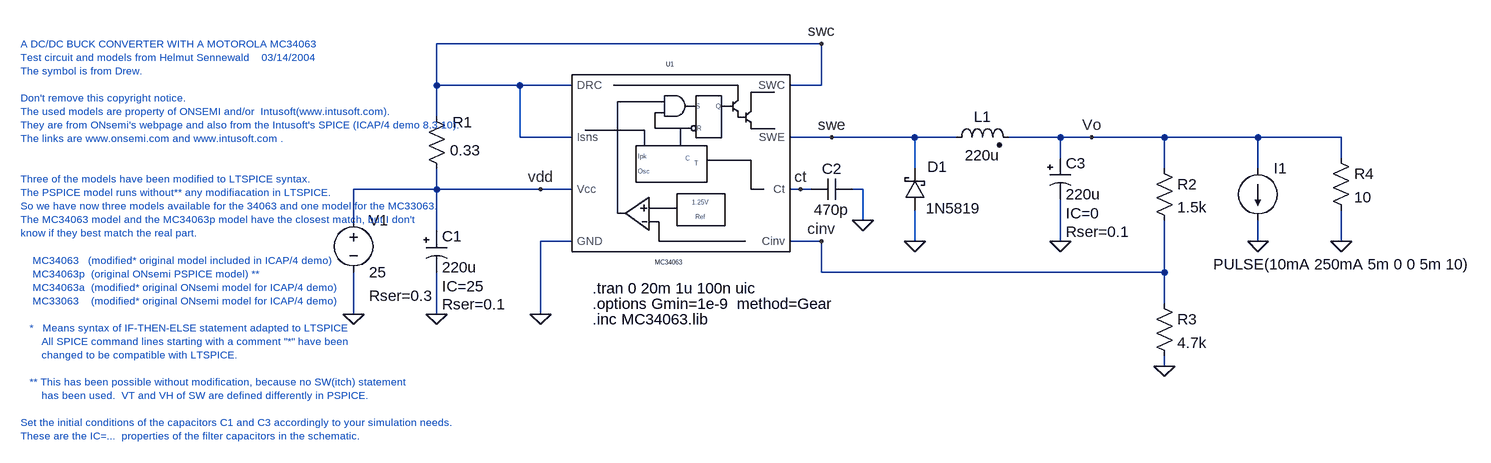
[diagram p0: schematic MC34063_buck.asc]
MC34063_buck.asc, the LTspice schematic file:
Version 4
SHEET 1 1572 772
WIRE 320 64 -272 64
WIRE -272 128 -272 64
WIRE -144 128 -272 128
WIRE -64 128 -144 128
WIRE 320 128 320 64
WIRE 320 128 272 128
WIRE -272 176 -272 128
WIRE -144 208 -144 128
WIRE -64 208 -144 208
WIRE 336 208 272 208
WIRE 464 208 336 208
WIRE 528 208 464 208
WIRE 688 208 608 208
WIRE 736 208 688 208
WIRE 848 208 736 208
WIRE 992 208 848 208
WIRE 1120 208 992 208
WIRE 688 240 688 208
WIRE 1120 240 1120 208
WIRE 464 256 464 208
WIRE 848 256 848 208
WIRE 992 256 992 208
WIRE -272 288 -272 256
WIRE -272 288 -400 288
WIRE -112 288 -272 288
WIRE -64 288 -112 288
WIRE 288 288 272 288
WIRE 304 288 288 288
WIRE 384 288 368 288
WIRE -400 336 -400 288
WIRE 384 336 384 288
WIRE -272 352 -272 288
WIRE -64 368 -112 368
WIRE 320 368 272 368
WIRE 464 368 464 320
WIRE 688 368 688 304
WIRE 992 368 992 336
WIRE 1120 368 1120 320
WIRE 320 416 320 368
WIRE 848 416 848 336
WIRE 848 416 320 416
WIRE 848 464 848 416
WIRE -400 480 -400 416
WIRE -272 480 -272 416
WIRE -112 480 -112 368
WIRE 848 560 848 544
FLAG -400 480 0
FLAG -272 480 0
FLAG 384 336 0
FLAG 464 368 0
FLAG 688 368 0
FLAG 736 208 Vo
FLAG 848 560 0
FLAG 992 368 0
FLAG -112 480 0
FLAG 288 288 ct
FLAG 336 208 swe
FLAG -112 288 vdd
FLAG 320 368 cinv
FLAG 1120 368 0
FLAG 320 64 swc
SYMBOL voltage -400 320 R0
WINDOW 123 0 0 Left 2
WINDOW 39 24 132 Left 2
SYMATTR SpiceLine Rser=0.3
SYMATTR InstName V1
SYMATTR Value 25
SYMBOL res -256 272 R180
WINDOW 0 -39 87 Left 2
WINDOW 3 -52 44 Left 2
SYMATTR InstName R1
SYMATTR Value 0.33
SYMBOL cap 304 304 R270
WINDOW 0 32 32 VTop 2
WINDOW 3 0 32 VBottom 2
SYMATTR InstName C2
SYMATTR Value 470p
SYMBOL schottky 480 320 R180
WINDOW 0 -34 67 Left 2
WINDOW 3 -86 3 Left 2
SYMATTR InstName D1
SYMATTR Value 1N5819
SYMATTR Description Diode
SYMATTR Type diode
SYMBOL ind2 512 224 R270
WINDOW 0 32 56 VTop 2
WINDOW 3 4 56 VBottom 2
SYMATTR InstName L1
SYMATTR Value 220u
SYMATTR SpiceLine Rser=0.5
SYMATTR Type ind
SYMBOL res 832 240 R0
SYMATTR InstName R2
SYMATTR Value 1.5k
SYMBOL res 832 448 R0
SYMATTR InstName R3
SYMATTR Value 4.7k
SYMBOL load2 992 256 R0
WINDOW 123 0 0 Left 2
WINDOW 39 0 0 Left 2
WINDOW 3 -69 147 Left 2
SYMATTR InstName I1
SYMATTR Value PULSE(10mA 250mA 5m 0 0 5m 10)
SYMBOL res 1104 224 R0
SYMATTR InstName R4
SYMATTR Value 10
SYMBOL polcap 672 240 R0
WINDOW 39 24 113 Left 2
WINDOW 40 24 85 Left 2
SYMATTR SpiceLine Rser=0.1
SYMATTR SpiceLine2 IC=0
SYMATTR InstName C3
SYMATTR Value 220u
SYMBOL polcap -288 352 R0
WINDOW 39 24 113 Left 2
WINDOW 40 24 85 Left 2
SYMATTR SpiceLine Rser=0.1
SYMATTR SpiceLine2 IC=25
SYMATTR InstName C1
SYMATTR Value 220u
SYMBOL mc34063 176 224 R0
SYMATTR InstName U1
TEXT -32 440 Left 2 !.tran 0 20m 1u 100n uic
TEXT -32 488 Left 2 !.inc MC34063.lib
TEXT -32 464 Left 2 !.options Gmin=1e-9  method=Gear
TEXT -912 64 Left 1 ;A DC/DC BUCK CONVERTER WITH A MOTOROLA MC34063\nTest circuit and models from Helmut Sennewald    03/14/2004\nThe symbol is from Drew.\n \nDon't remove this copyright notice.\nThe used models are property of ONSEMI and/or  Intusoft(www.intusoft.com).\nThey are from ONsemi's webpage and also from the Intusoft's SPICE (ICAP/4 demo 8.3.10).\nThe links are www.onsemi.com and www.intusoft.com .\n \n \nThree of the models have been modified to LTSPICE syntax.\nThe PSPICE model runs without** any modifiacation in LTSPICE.\nSo we have now three models available for the 34063 and one model for the MC33063. \nThe MC34063 model and the MC34063p model have the closest match, but I don't\nknow if they best match the real part.\n \n    MC34063   (modified* original model included in ICAP/4 demo)\n    MC34063p  (original ONsemi PSPICE model) **\n    MC34063a  (modified* original ONsemi model for ICAP/4 demo)\n    MC33063    (modified* original ONsemi model for ICAP/4 demo) \n \n   *   Means syntax of IF-THEN-ELSE statement adapted to LTSPICE\n       All SPICE command lines starting with a comment "*" have been \n       changed to be compatible with LTSPICE. \n      \n   ** This has been possible without modification, because no SW(itch) statement \n       has been used.  VT and VH of SW are defined differently in PSPICE.\n \nSet the initial conditions of the capacitors C1 and C3 accordingly to your simulation needs.\nThese are the IC=...  properties of the filter capacitors in the schematic.

The netlist it stands for:
* MC34063_buck.asc
V1 vdd 0 25 Rser=0.3
R1 vdd swc 0.33
C2 ct 0 470p
D1 0 swe 1N5819
L1 swe Vo 220u Rser=0.5
R2 Vo cinv 1.5k
R3 cinv 0 4.7k
I1 Vo 0 PULSE(10mA 250mA 5m 0 0 5m 10)
R4 Vo 0 10
C3 Vo 0 220u Rser=0.1 IC=0
C1 vdd 0 220u Rser=0.1 IC=25
XU1 swc swe ct 0 cinv vdd swc swc MC34063  ; pins SWC SWE Ct GND Cinv Vcc Isns DRC
.model D D
.lib standard.dio
.tran 0 20m 1u 100n uic
.inc MC34063.lib
.options Gmin=1e-9  method=Gear
* A DC/DC BUCK CONVERTER WITH A MOTOROLA MC34063
* Test circuit and models from Helmut Sennewald    03/14/2004
* The symbol is from Drew.
* Don't remove this copyright notice.
* The used models are property of ONSEMI and/or  Intusoft(www.intusoft.com).
* They are from ONsemi's webpage and also from the Intusoft's SPICE (ICAP/4 demo 8.3.10).
* The links are www.onsemi.com and www.intusoft.com .
* Three of the models have been modified to LTSPICE syntax.
* The PSPICE model runs without** any modifiacation in LTSPICE.
* So we have now three models available for the 34063 and one model for the MC33063.
* The MC34063 model and the MC34063p model have the closest match, but I don't
* know if they best match the real part.
*     MC34063   (modified* original model included in ICAP/4 demo)
*     MC34063p  (original ONsemi PSPICE model) **
*     MC34063a  (modified* original ONsemi model for ICAP/4 demo)
*     MC33063    (modified* original ONsemi model for ICAP/4 demo)
*    *   Means syntax of IF-THEN-ELSE statement adapted to LTSPICE
*        All SPICE command lines starting with a comment "*" have been
*        changed to be compatible with LTSPICE.
*    ** This has been possible without modification, because no SW(itch) statement
*        has been used.  VT and VH of SW are defined differently in PSPICE.
* Set the initial conditions of the capacitors C1 and C3 accordingly to your simulation needs.
* These are the IC=...  properties of the filter capacitors in the schematic.
.backanno
.end